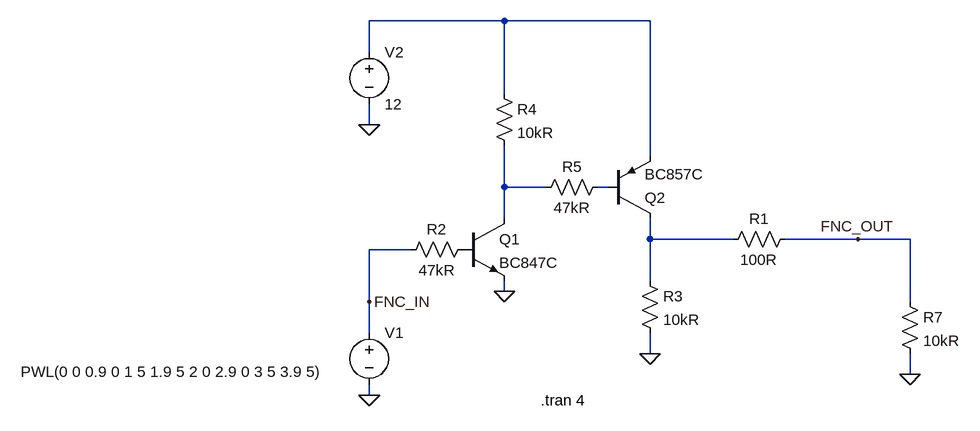
[diagram p0: schematic FUNCTION_output_circuit.asc]
FUNCTION_output_circuit.asc, the LTspice schematic file:
Version 4
SHEET 1 1620 784
WIRE -32 -16 -240 -16
WIRE 192 -16 -32 -16
WIRE -240 32 -240 -16
WIRE -32 96 -32 -16
WIRE -240 144 -240 112
WIRE 192 192 192 -16
WIRE -32 240 -32 176
WIRE 32 240 -32 240
WIRE 128 240 112 240
WIRE -32 288 -32 240
WIRE 192 320 192 288
WIRE 320 320 192 320
WIRE 512 320 400 320
WIRE 592 320 512 320
WIRE -176 336 -240 336
WIRE 192 384 192 320
WIRE -32 400 -32 384
WIRE -240 416 -240 336
WIRE 592 416 592 320
WIRE -240 464 -240 416
WIRE 192 496 192 464
WIRE 592 528 592 496
WIRE -240 560 -240 544
FLAG 192 496 0
FLAG -240 144 0
FLAG -240 416 FNC_IN
FLAG -240 560 0
FLAG 512 320 FNC_OUT
FLAG 592 528 0
FLAG -32 400 0
SYMBOL npn -96 288 R0
SYMATTR InstName Q1
SYMATTR Value BC847C
SYMBOL res -80 320 R90
WINDOW 0 0 56 VBottom 2
WINDOW 3 32 56 VTop 2
SYMATTR InstName R2
SYMATTR Value 47kR
SYMBOL res 176 368 R0
SYMATTR InstName R3
SYMATTR Value 10kR
SYMBOL voltage -240 16 R0
WINDOW 123 0 0 Left 0
WINDOW 39 0 0 Left 0
SYMATTR InstName V2
SYMATTR Value 12
SYMBOL voltage -240 448 R0
WINDOW 3 -536 76 Left 2
WINDOW 123 0 0 Left 0
WINDOW 39 0 0 Left 0
SYMATTR Value PWL(0 0 0.9 0 1 5 1.9 5 2 0 2.9 0 3 5 3.9 5)
SYMATTR InstName V1
SYMBOL res 576 400 R0
SYMATTR InstName R7
SYMATTR Value 10kR
SYMBOL res 416 304 R90
WINDOW 0 0 56 VBottom 2
WINDOW 3 32 56 VTop 2
SYMATTR InstName R1
SYMATTR Value 100R
SYMBOL pnp 128 288 M180
SYMATTR InstName Q2
SYMATTR Value BC857C
SYMBOL res -48 80 R0
SYMATTR InstName R4
SYMATTR Value 10kR
SYMBOL res 128 224 R90
WINDOW 0 0 56 VBottom 2
WINDOW 3 32 56 VTop 2
SYMATTR InstName R5
SYMATTR Value 47kR
TEXT 24 568 Left 2 !.tran 4

The netlist it stands for:
* FUNCTION_output_circuit.asc
Q1 N002 P001 0 0 BC847C
R2 P001 FNC_IN 47kR
R3 N004 0 10kR
V2 N001 0 12
V1 FNC_IN 0 PWL(0 0 0.9 0 1 5 1.9 5 2 0 2.9 0 3 5 3.9 5)
R7 FNC_OUT 0 10kR
R1 FNC_OUT N004 100R
Q2 N004 N003 N001 0 BC857C
R4 N001 N002 10kR
R5 N003 N002 47kR
.model NPN NPN
.model PNP PNP
.lib standard.bjt
.tran 4
.backanno
.end